# EAGLE design TokTok_WiFi (EAGLE 6.4)
COMPANY: ADAFRUIT INDUSTRIES; DRAWN: KTOWN; REV: C
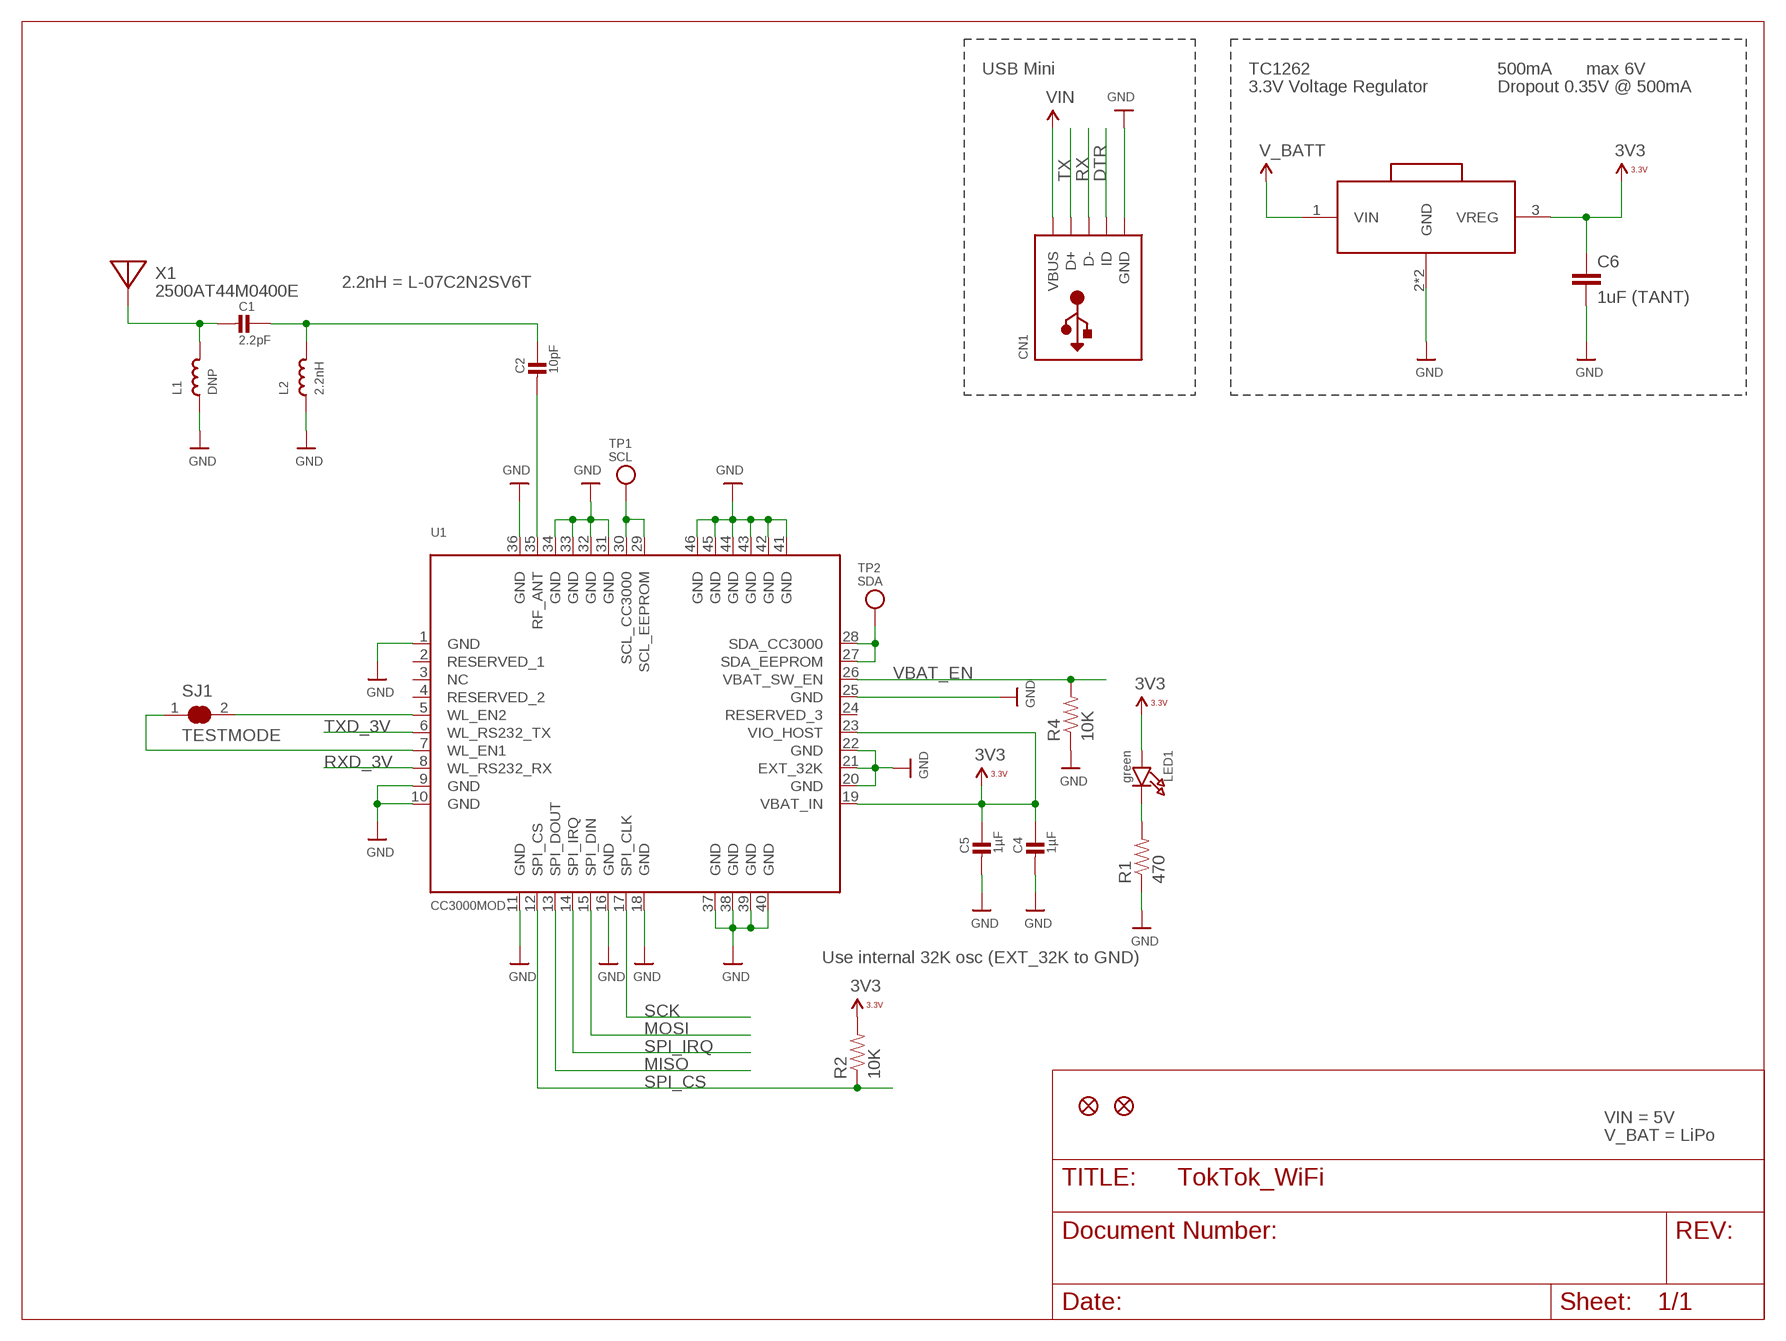
[diagram p0: schematic, sheet 1, part 1 of 2]
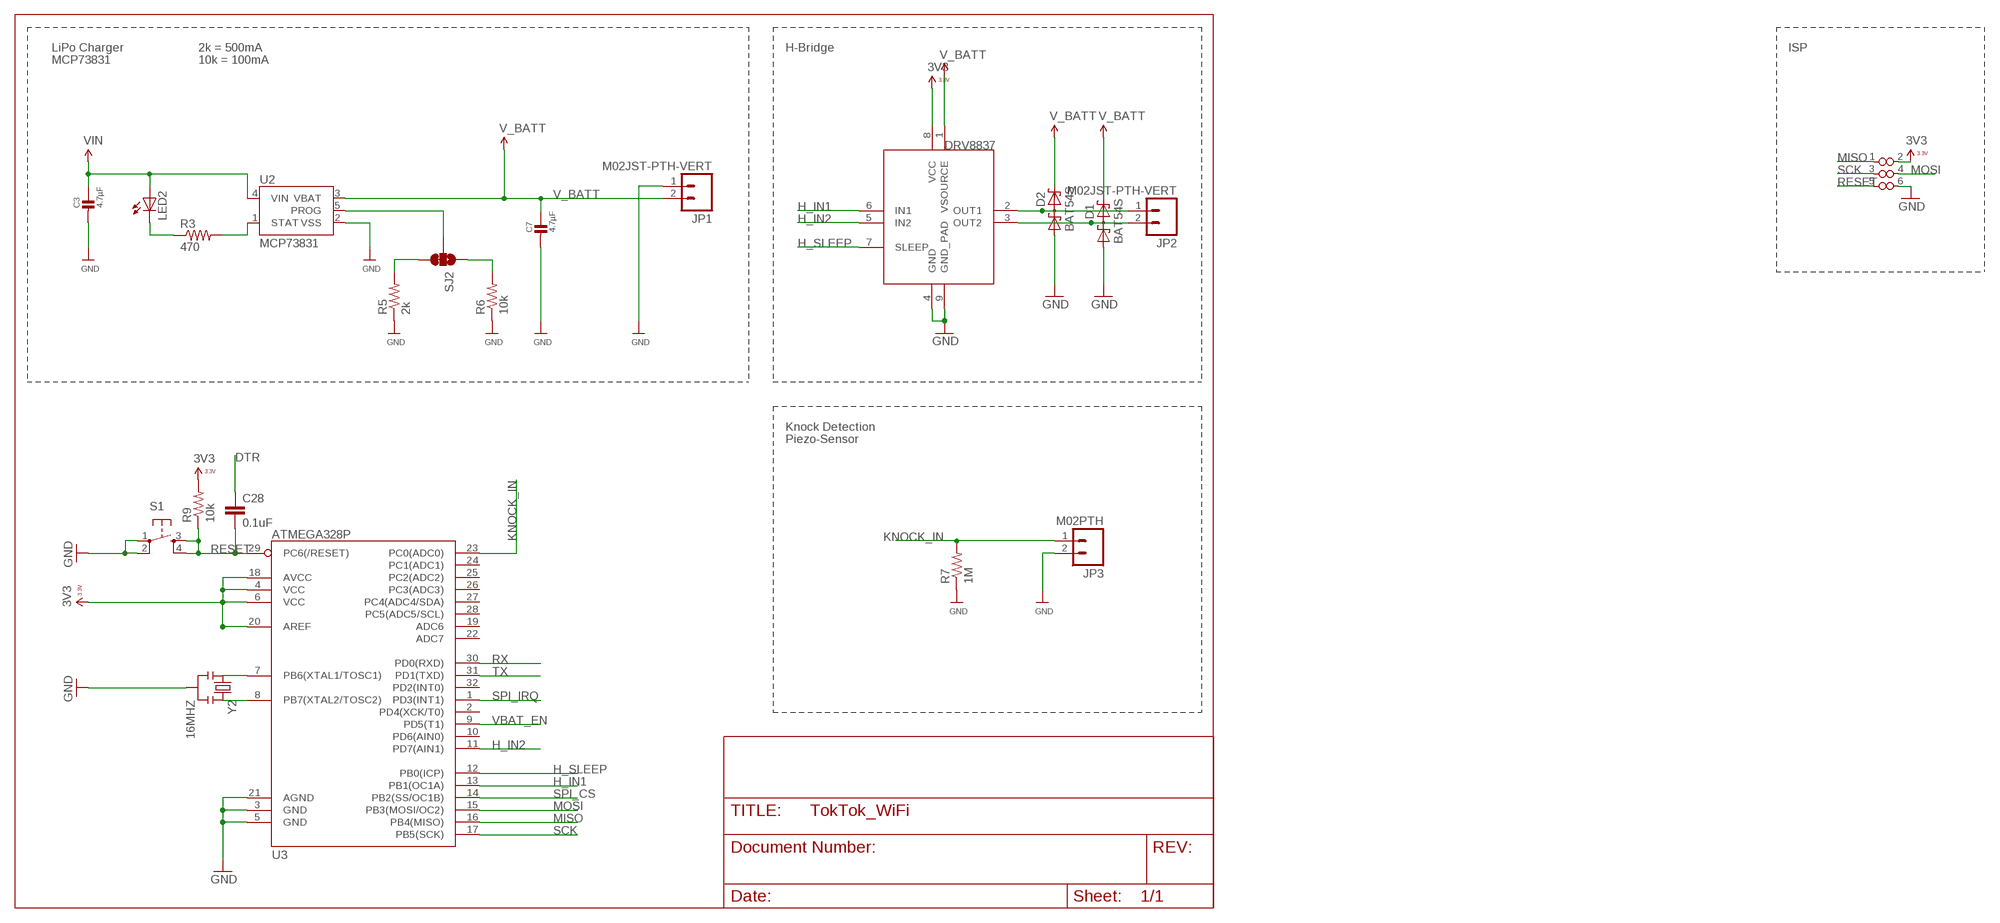
[diagram p1: schematic, sheet 1, part 2 of 2]

## Parts
C1  2.2pF  CAP_CERAMIC_0402  [_0402]
C2  10pF  CAP_CERAMIC_0402  [_0402]
C3  4.7µF  CAP_CERAMIC_0805MP  [_0805MP]
C4  1µF  CAP_CERAMIC_0805MP  [_0805MP]
C5  1µF  CAP_CERAMIC_0805MP  [_0805MP]
C6  1uF (TANT)  CAP1206  [1206]
C7  4.7µF  CAP_CERAMIC_0805MP  [_0805MP]
C28  0.1uF  CAP0805  [0805]
CN1  USBMINIB  [USB-MINIB]
D1  BAT54S  [SOT23]
D2  BAT54S  [SOT23]
FID1  FIDUCIAL""  [FIDUCIAL_1MM]
FID3  FIDUCIAL""  [FIDUCIAL_1MM]
IC2  DRV8837  [WSON-8]
JP1  M02JST-PTH-VERT  [JST-2-PTH-VERT]
JP2  M02JST-PTH-VERT  [JST-2-PTH-VERT]
JP3  M02PTH  [1X02]
L1  DNP  INDUCTOR_0402  [_0402]
L2  2.2nH  INDUCTOR_0402  [_0402]
LED1  green  LED0805_NOOUTLINE  [CHIPLED_0805_NOOUTLINE]
LED2  LEDCHIP-LED0805  [CHIP-LED0805]
R1  470  RESISTOR0805-RES  [0805]
R2  10K  RESISTOR0805-RES  [0805]
R3  470  RESISTOR0805-RES  [0805]
R4  10K  RESISTOR0805-RES  [0805]
R5  2k  RESISTOR0805-RES  [0805]
R6  10k  RESISTOR0805-RES  [0805]
R7  1M  RESISTOR0805-RES  [0805]
R9  10k  R-US_M0805  [M0805]
S1  TAC_SWITCHSMD  [TACTILE-SWITCH-SMD]
SJ1  TESTMODE  SOLDERJUMPER_CLOSED  [SOLDERJUMPER_CLOSEDWIRE]
SJ2  JUMPER-PAD-3-2OF3_NC_BY_TRACE_SMALL  [PAD-JUMPER-3-2OF3_NC_BY_TRACE_YES_SILK_FULL_BOX]
TP1  SCL  TESTPOINTPAD1MM  [TESTPOINT_PAD_1MM]
TP2  SDA  TESTPOINTPAD1MM  [TESTPOINT_PAD_1MM]
U1  CC3000MOD  [CC3000MOD]
U2  MCP73831  [SOT23-5]
U3  ATMEGA328P  ATMEGA328_SMT  [TQFP32-08]
U$3  TC1262  [SOT223]
U$36  ISP_POGO  [POGO_ISP]
X1  2500AT44M0400E  ANTENNA_JOHANSON_2500AT44M0400  [ANT_2500AT44M0400]
Y2  16MHZ  RESONATOR8MHZ  [RESONATOR-SMD]

## Nets
3V3: C4.1 C5.1 C6.1 IC2.8(VCC) LED1.A R2.2 R9.2 U1.19(VBAT_IN) U1.23(VIO_HOST) U3.4(VCC) U3.6(VCC) U3.18(AVCC) U3.20(AREF) U$3.3(VREG) U$36.2(VCC)
DTR: C28.1 CN1.ID
GND: C3.2 C4.2 C5.2 C6.2 C7.2 CN1.GND D1.1(A1) D2.1(A1) IC2.4(GND) IC2.9(GND_PAD) JP1.1 JP3.2 L1.1 L2.1 R1.1 R4.1 R5.1 R6.1 R7.1 S1.1 S1.2 U1.1(GND) U1.9(GND) U1.10(GND) U1.11(GND) U1.16(GND) U1.18(GND) U1.20(GND) U1.21(EXT_32K) U1.22(GND) U1.25(GND) U1.31(GND) U1.32(GND) U1.33(GND) U1.34(GND) U1.36(GND) U1.37(GND) U1.38(GND) U1.39(GND) U1.40(GND) U1.41(GND) U1.42(GND) U1.43(GND) U1.44(GND) U1.45(GND) U1.46(GND) U2.2(VSS) U3.3(GND) U3.5(GND) U3.21(AGND) U$3.2(GND) U$3.4(GND) U$36.6(GND) Y2.2
H_IN1: IC2.6(IN1) U3.13(PB1(OC1A))
H_IN2: IC2.5(IN2) U3.11(PD7(AIN1))
H_SLEEP: IC2.7(SLEEP) U3.12(PB0(ICP))
KNOCK_IN: JP3.1 R7.2 U3.23(PC0(ADC0))
MISO: U1.13(SPI_DOUT) U3.16(PB4(MISO)) U$36.1(MISO)
MOSI: U1.15(SPI_DIN) U3.15(PB3(MOSI/OC2)) U$36.4(MOSI)
N$1: C1.2 L1.2 X1.FEED
N$2: C1.1 C2.1 L2.2
N$3: R3.2 U2.1(STAT)
N$4: C2.2 U1.35(RF_ANT)
N$5: SJ1.2 U1.5(WL_EN2)
N$6: SJ1.1 U1.7(WL_EN1)
N$7: LED1.C R1.2
N$8: LED2.C R3.1
N$9: SJ2.2 U2.5(PROG)
N$10: U3.7(PB6(XTAL1/TOSC1)) Y2.1
N$11: R5.2 SJ2.3
N$12: R6.2 SJ2.1
N$13: U3.8(PB7(XTAL2/TOSC2)) Y2.3
N$21: D2.3(C1A2) IC2.2(OUT1) JP2.1
N$23: D1.3(C1A2) IC2.3(OUT2) JP2.2
RESET: C28.2 R9.1 S1.3 S1.4 U3.29(PC6(/RESET)) U$36.5(RESET)
RX: CN1.D- U3.30(PD0(RXD))
RXD_3V: U1.8(WL_RS232_RX)
SCK: U1.17(SPI_CLK) U3.17(PB5(SCK)) U$36.3(SCK)
SCL_3V: TP1.P$1 U1.29(SCL_EEPROM) U1.30(SCL_CC3000)
SDA_3V: TP2.P$1 U1.27(SDA_EEPROM) U1.28(SDA_CC3000)
SPI_CS: R2.1 U1.12(SPI_CS) U3.14(PB2(SS/OC1B))
SPI_IRQ: U1.14(SPI_IRQ) U3.1(PD3(INT1))
TX: CN1.D+ U3.31(PD1(TXD))
TXD_3V: U1.6(WL_RS232_TX)
V_BATT: C7.1 D1.2(C2) D2.2(C2) IC2.1(VSOURCE) JP1.2 U2.3(VBAT) U$3.1(VIN)
VBAT_EN: R4.2 U1.26(VBAT_SW_EN) U3.9(PD5(T1))
VIN: C3.1 CN1.VBUS LED2.A U2.4(VIN)
Unconnected: U1.2(RESERVED_1) U1.3(NC) U1.4(RESERVED_2) U1.24(RESERVED_3) U3.2(PD4(XCK/T0)) U3.10(PD6(AIN0)) U3.19(ADC6) U3.22(ADC7) U3.24(PC1(ADC1)) U3.25(PC2(ADC2)) U3.26(PC3(ADC3)) U3.27(PC4(ADC4/SDA)) U3.28(PC5(ADC5/SCL)) U3.32(PD2(INT0))

## Notes on the sheet
- USB Mini | TC1262 | 500mA | max 6V | LiPo Charger | 2k = 500mA | H-Bridge | ISP
- 3.3V Voltage Regulator | Dropout 0.35V @ 500mA | MCP73831 | 10k = 100mA
- 2.2nH = L-07C2N2SV6T
- Knock Detection
- Piezo-Sensor
- Use internal 32K osc (EXT_32K to GND)
- VIN = 5V
- V_BAT = LiPo

## Library data of the parts
C1-C5 C7 = microbuilder:CAP_CERAMIC: Ceramic Capacitors For new designs, use the packages preceded by an '_' character since they are more reliable: The following footprints should be used on most boards: _0402 - Standard footprint for regular board layouts _0603 - Standard footprint for regular board layouts _0805 - Standard footprint for regular board layouts For extremely tight-pitch boards where space is at a premium, the following 'micro-pitch' footprints can be used (smaller pads, no silkscreen outline, etc.): _0402MP - Micro-pitch footprint for very dense/compact boards _0603MP - Micro-pitch footprint for very dense/compact boards _0805MP - Micro-pitch footprint for very dense/compact boards Commonly Stocked Parts 0402 - 0402 Surface Mount Capacitors 16pF 50V 5% [Digikey: 445-4899-2-ND] 18pF 50V 5% [Digikey: 490-1281-2-ND] 22pF 50V 5% [Digikey: 490-1283-2-ND] 68pF 50V 5% [Digikey: 490-1289-2-ND] 0.1uF 10V 10% [Digikey: 490-1318-2-ND] 1.0uF 6.3V 10% [Digikey: 490-1320-2-ND] 0603 - 0603 Surface Mount Capacitors 16 pF 50V 5% [Digikey: 445-5051-2-ND] 22 pF 50V [Digikey: PCC220ACVTR-ND] 33 pF 50V 5% [Digikey: 490-1415-1-ND] 56pF 50V 5% [Digikey: 490-1421-1-ND] 220pF 50V 5% [Digikey: 445-1285-1-ND] 680 pF 50V 2200 pF 50V 5% C0G [Digikey: 445-1297-1-ND] 5600 pF 100V 5% X7R [Digikey: 478-3711-1-ND] 0.1 µF 25V 10% [Digikey: PCC2277TR-ND] 0.22 µF 16V 10% X7R [Digikey: 445-1318-1-ND] 1.0 µF 25V 10% [Digikey: 445-5146-2-ND] 0603 - RF Specific 3pF 250V +/-0.1pF RF [Digikey: 712-1347-1-ND] 18 pF 250V 5% [Digikey: 478-3505-1-ND or 712-1322-1-ND] 56 pF 250V 5% C0G RF [Digikey: 490-4867-1-ND] 68 pF 250V RF [Digikey: 490-4868-1-ND] 0805 - 0805 Surface Mount Capacitors 220 pF 250V 2% RF Ceramic Capacitor [Digikey: 712-1398-1-ND] 1000 pF 50V 2% NP0 Ceramic Capacitor [Digikey: 478-3760-1-ND] 0.1 µF 25V 10% Ceramic Capacitor [Digikey: PCC1828TR-ND] 1.0 µF 16V 10% Ceramic Capacitor[Digikey: 490-1691-2-ND] 10.0 µF 10V 10% Ceramic Capacitor[Digikey: 709-1228-1-ND] 10.0 uF 16V 10% Ceramic Capacitor [Digikey: 478-5165-2-ND] 47 uF 6.3V 20% Ceramic Capacitor [Digikey: 587-1779-1-ND or 399-5506-1-ND] 1206 - 1206 Surface Mount Capacitors 47uF 10V 20% Ceramic Capacitor [Digikey: 490-5528-1-ND or 399-5508-1-ND or 445-6010-1-ND] 100uF 6.3V -20%, +80% Y5V Ceramic Capacitor (Digikey: 490-4512-1-ND, Mouser: 81-GRM31CF50J107ZE1L)
C6 C28 = SparkFun-Capacitors:CAP: Capacitor Standard 0603 ceramic capacitor, and 0.1" leaded capacitor.
CN1 = adafruit:USB: USB Connectors USBMINIB - Surface Mount Female Mini-B USB Connector 4UConnector: 06564 By microbuilder.eu Thru-hole RA Female Mini-B USB Connector 4UConnector: 18732 By ladyada.net
D1 D2 = diode:BAT54S: Schottky Diodes Pin connection corrected 2011-05-04 Source: Fairchild .. BAT54.pdf
FID1 FID3 = microbuilder:FIDUCIAL: Fiducial Alignment Points Various fiducial points for machine vision alignment.; BOM: EXCLUDE
IC2 = digikey:DRV8837: DRV8837 DSG - H-Bridge
JP1-JP3 = SparkFun-Connectors:M02: Standard 2-pin 0.1" header. Use with - straight break away headers ( PRT-00116) - right angle break away headers (PRT-00553) - swiss pins (PRT-00743) - machine pins (PRT-00117) - female headers (PRT-00115) Molex polarized connector foot print use with: PRT-08233 with associated crimp pins and housings. 2.54_SCREWTERM for use with PRT-10571. 3.5mm Screw Terminal footprints for PRT-08084 5mm Screw Terminal footprints for use with PRT-08432
L1 L2 = microbuilder:INDUCTOR: Inductors 0603: 10nH Ceramic Inductor - microwire antenna/RF (Digikey: 712-1434-2-ND) 0805: 560nH Ceramic Inductor - RF (Digikey: 553-1047-1-ND) 270nH Ceramic Inductor - Q = 40@250MHz, +-5%, 1 Ohm DC Resistance (Digikey: 535-10506-2-ND) 1007 (2518 Metric) SMT: 10µH 10% 250mOhm 820mA 1007 Inductor (Digikey: 587-2189-1-ND) 22µH 10% 500mOhm 580mA 1007 Inductor (Digikey: 587-2190-1-ND) 47µH 10% 950mOhm 420mA 1007 Inductor (Digikey: 587-2191-1-ND) 47µH 5% 100mOhm 1A 1008 Inductor (Digikey: 732-1816-1-ND) 5.0x5.0mm (Taiyo Yuden NR5040 Series) 6.8µH 20% 2.3A 64mOhm Inductor (Digikey: 587-2374-2-ND) 5.0x5.0mm (TDK VLC5045 Series) 4.7µH 20% 3.3A 34mOhm Inductor (Digikey: 445-6526-1-ND) 6.8µH 20% 2.7A 46mOhm Inductor (Digikey: 445-6527-1-ND) 6.0x6.0mm (TDK VLC6045 Series) 4.7µH 20% 3.8A 27mOhm Inductor (Digikey: 445-6538-2-ND) 6.8µH 20% 3A 41mOhm Inductor (Digikey: 445-6540-1-ND) 6.2µH 30% 2.2A 45mOhm Inductor (Digikey: SRR5028-6R2YCT-ND) - Not TDK VLC6045 but footprint should match 6.0x6.0mm (TDK SLF6045 Series) 6.8uH 30% 2A 33mOhm Inductor (Digikey: 445-4572-1-ND, Mouser: 810-SLF645T6R8N2R0PF) 6.0x6.0mm (Sumida CDRH5D28 Series) 6.2uH 30% 1.8A 45mOhm Inductor (Digikey: 308-1542-1-ND) Taiyo Yuden NR3015T2R2M - 2.2uH 20% 1.5A (Digikey: 587-1648-2-ND, Mouser: 963-NR3015T2R2M) - Used with TI TPS62172 CoilCraft RFID Transponder Coil - MA5532-AE (For use with AS3935 Lightning Sensor)
LED1 = microbuilder:LED: LED
LED2 = adafruit:LED: LED
R1-R7 = SparkFun-Resistors:RESISTOR: Resistor Basic schematic elements and footprints for 0603, 1206, and PTH resistors.
R9 = resistor:R-US_: RESISTOR, American symbol
S1 = SparkFun-Electromechanical:TAC_SWITCH: Momentary Switch Button commonly used for reset or general input. Spark Fun Electronics SKU : COM-00097 SMT- SWCH-08247
SJ1 = microbuilder:SOLDERJUMPER_CLOSED: Solder Jumper - Closed These solder jumpers are closed by default CLOSEDWIRE - 10 mil trace between pads that can be cut and resoldered later CLOSEDPERM - 63 mil trace between pads for a permanent connection (used to 'bridge' two signals, a shameless hack for Eagle). Can double as a test point as well (no cream layer)
SJ2 = SparkFun-Passives:JUMPER-PAD-3-2OF3_NC_BY_TRACE
TP1 TP2 = microbuilder:TESTPOINT: Test Point Various test points for characterisation and PCB testing TESTPOINT_SMT - Compact Surface Mount Test Point [Digikey: 5016KTR-ND]
U1 = microbuilder:CC3000MOD: CC3000MOD Wifi Module
U2 = SparkFun-PowerIC:MCP73831: Miniature single cell, fully integrated Li-Ion, Li-polymer charge management controller http://ww1.microchip.com/downloads/en/DeviceDoc/21984a.pdf IC-09995; PROD_ID: IC-09995
U3 = SparkFun-DigitalIC:ATMEGA328_SMT: 32-Pin Atmega328 part Commonly used on Arduino compatible boards Available in QFP and QFN packages TQFP is IC-09069 QFN is non-stock; PROD_ID: IC-09069
U$3 = digikey:TC1262
U$36 = digikey:ISP_POGO
X1 = microbuilder:ANTENNA_JOHANSON_2500AT44M0400: Johanson 2.3-2.7 GHz Chip Antenna Frequency Range: 2400 - 2500 Mhz Peak Gain 2.5 dBi typ. (XZ-V) Average Gain 0.5 dBi typ. (XZ-V) Input Power 3W max. Operating Temperature -40 to +85°C Digikey: 712-1403-1-ND Mouser: 609-2500AT44M0400E
Y2 = SparkFun-FreqCtrl:RESONATOR: Resonator Small SMD resonator. Used, eg, on the Arduino Pro/ Pro Mini boards. 8MHz- XTAL-08895 16MHz- XTAL-08900; PROD_ID: XTAL-08895; VALUE: 8MHZ

## Board
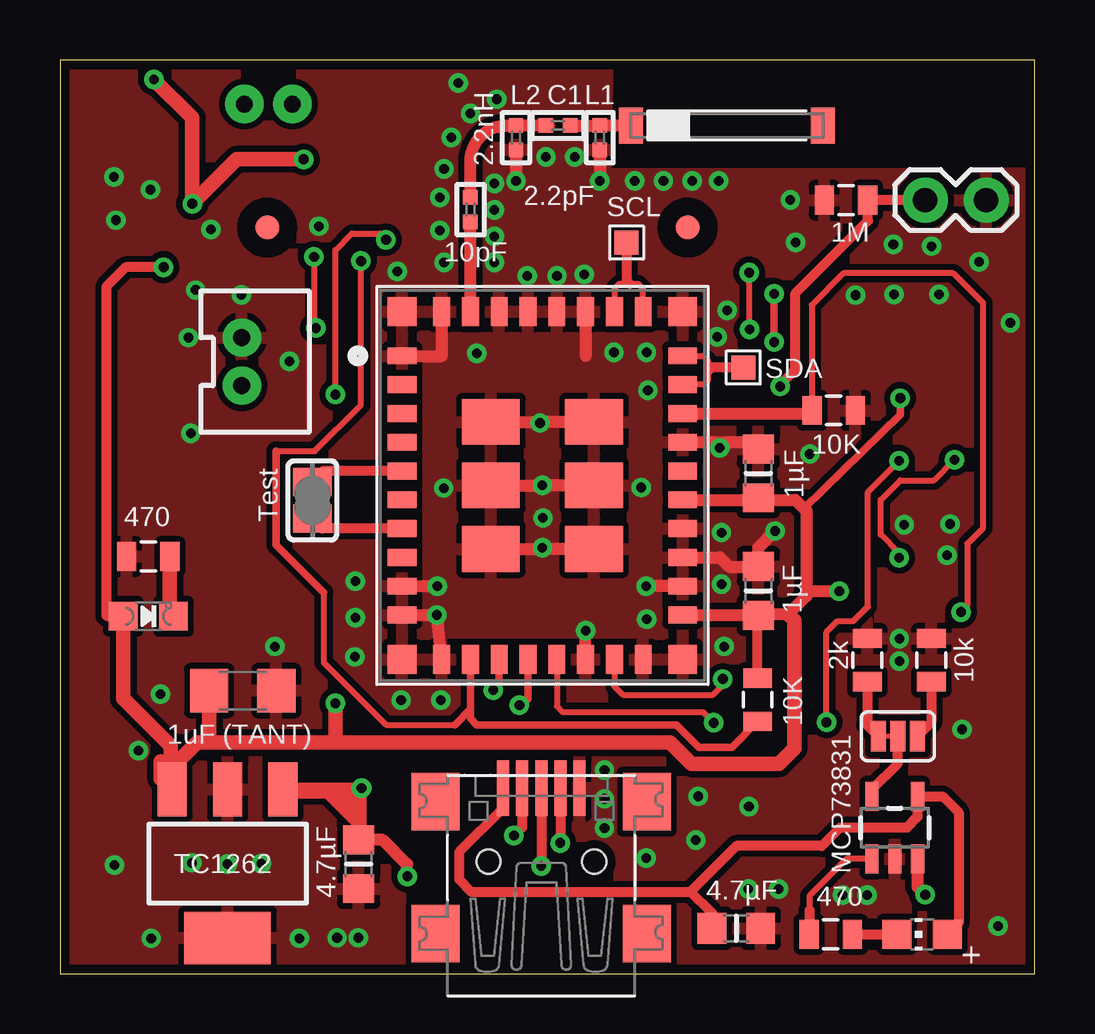
[diagram p2: board, top side]
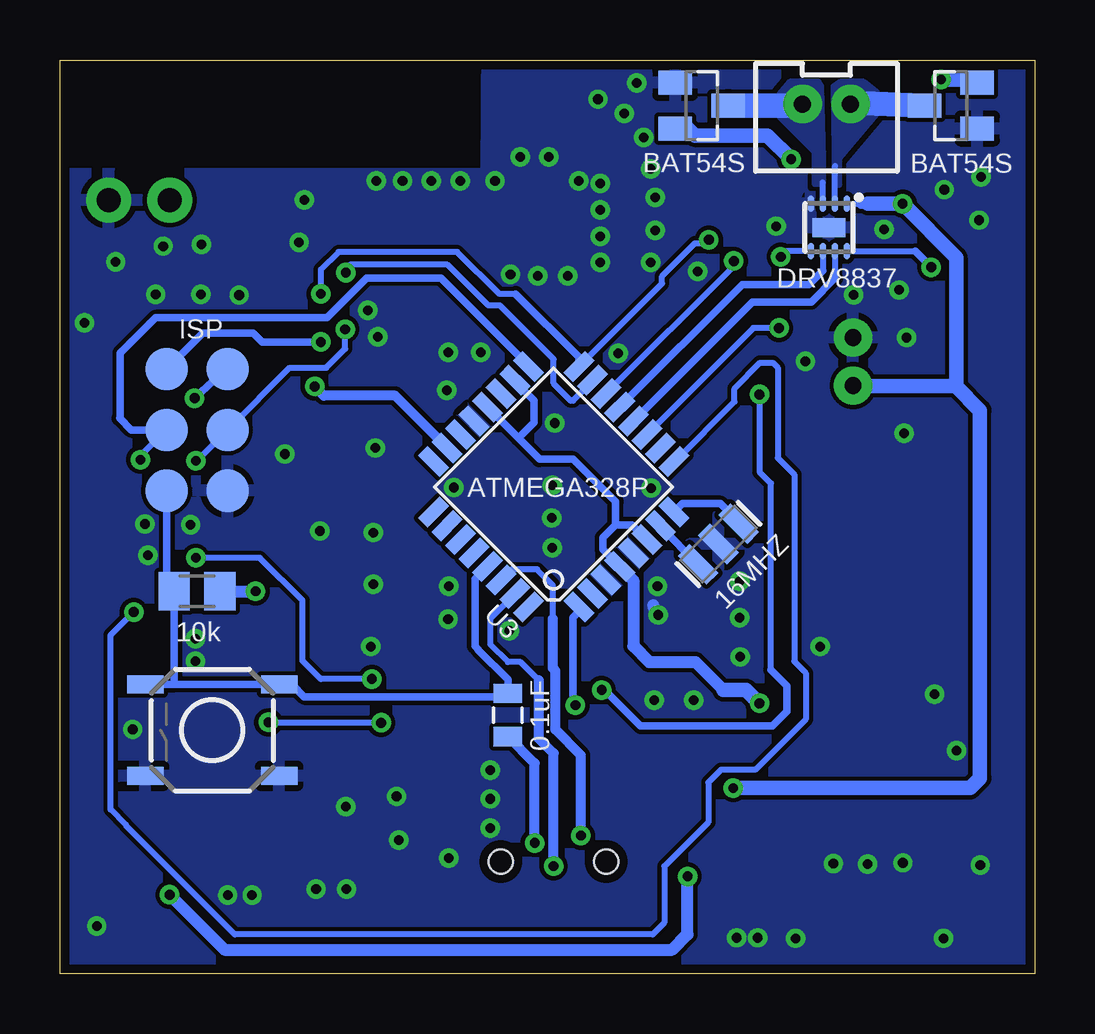
[diagram p3: board, bottom side, seen from below]

Size 40.64 x 38.1 mm. Coordinates in mm from the lower left corner, seen from the top.
Outline: 0,0 40.64,0 40.64,38.1 0,38.1 0,0
Copper layers (1*16): Top 0.035mm / dielectric 1.5mm / Bottom 0.035mm
Design rules "adafruit *": minimum track width 7mil, minimum drill 13mil, track to track 7mil, track to pad 7mil, pad to pad 7mil, via to via 7mil, smd to smd 7mil, copper to edge 15mil, drill to drill 8mil, minimum pad ring 10mil, minimum via ring 8mil, stop-mask expansion 4mil, vias tented up to drill 20mil, thermal gap 10mil

### Footprints (pad centres in the part's own frame; a part is rotated, then mirrored left to right if it is on the bottom)
_0402 = smd 0.6 x 0.6: 1 -0.508,0; 2 0.508,0
_0805MP = smd 1.2 x 1.3: 1 -1.016,0; 2 1.016,0
1206 = smd 1.6 x 1.8: 1 -1.4,0; 2 1.4,0
0805 = smd 0.8 x 1.2: 1 -0.9,0; 2 0.9,0
USB-MINIB = smd 0.5 x 2.308: D+ 0,4.064; D- -0.8,4.064; GND 1.6,4.064; ID 0.8,4.064; VBUS -1.6,4.064 | smd 2 x 2.4: GND1 -4.4,-2; GND2 -4.4,3.5; GND3 4.4,3.5; GND4 4.4,-2 | hole 1: -2.2,1; 2.2,1
SOT23 = smd 1 x 1.4: 1 -0.95,-1.1; 2 0.95,-1.1; 3 0,1.1
FIDUCIAL_1MM = smd 1 x 1: 1 0,0
WSON-8 = smd 0.7 x 0.279: 1 -0.99,0.75; 2 -0.99,0.25; 3 -0.99,-0.25; 4 -0.99,-0.75; 5 0.99,-0.75; 6 0.99,-0.25; 7 0.99,0.25; 8 0.99,0.75 | smd 0.8 x 1.38: 9 0,0
JST-2-PTH-VERT = drill 0.7 pad 1.6: 1 -1,-0.55; 2 1,-0.55
1X02 = drill 1.016 pad 1.88: 1 0,0; 2 2.54,0
CHIPLED_0805_NOOUTLINE = smd 1.2 x 1.2: A 0,-1.05; C 0,1.05
CHIP-LED0805 = smd 1.2 x 1.2: A 0,-1.05; C 0,1.05
M0805 = smd 1.3 x 1.6: 1 -0.95,0; 2 0.95,0
TACTILE-SWITCH-SMD = smd 1.524 x 0.762: 1 -2.794,1.905; 2 2.794,1.905; 3 -2.794,-1.905; 4 2.794,-1.905
SOLDERJUMPER_CLOSEDWIRE = smd 1.168 x 1.6: 1 -0.762,0; 2 0.762,0 | smd 0.635 x 0.203: WIRE 0,0
PAD-JUMPER-3-2OF3_NC_BY_TRACE_YES_SILK_FULL_BOX = smd 0.635 x 1.27: 1 -0.813,0; 2 0,0; 3 0.813,0
TESTPOINT_PAD_1MM = smd 1 x 1: P$1 0,0
CC3000MOD = smd 1.2 x 0.7: 1 -5.85,5.4; 2 -5.85,4.2; 3 -5.85,3; 4 -5.85,1.8; 5 -5.85,0.6; 6 -5.85,-0.6; 7 -5.85,-1.8; 8 -5.85,-3; 9 -5.85,-4.2; 10 -5.85,-5.4; 19 5.85,-5.4; 20 5.85,-4.2; 21 5.85,-3; 22 5.85,-1.8; 23 5.85,-0.6; 24 5.85,0.6; 25 5.85,1.8; 26 5.85,3; 27 5.85,4.2; 28 5.85,5.4 | smd 0.7 x 1.2: 11 -4.2,-7.25; 12 -3,-7.25; 13 -1.8,-7.25; 14 -0.6,-7.25; 15 0.6,-7.25; 16 1.8,-7.25; 17 3,-7.25; 18 4.2,-7.25; 29 4.2,7.25; 30 3,7.25; 31 1.8,7.25; 32 0.6,7.25; 33 -0.6,7.25; 34 -1.8,7.25; 35 -3,7.25; 36 -4.2,7.25 | smd 2.4 x 1.9: 37 -2.15,2.65; 38 -2.15,0; 39 -2.15,-2.65; 40 2.15,2.65; 41 2.15,0; 42 2.15,-2.65 | smd 1.2 x 1.2: 43 -5.85,7.25; 44 -5.85,-7.25; 45 5.85,-7.25; 46 5.85,7.25
SOT23-5 = smd 0.55 x 1.2: 1 -0.95,-1.3; 2 0,-1.3; 3 0.95,-1.3; 4 0.95,1.3; 5 -0.95,1.3
TQFP32-08 = smd 1.27 x 0.559: 1 -4.293,2.8; 2 -4.293,2; 3 -4.293,1.2; 4 -4.293,0.4; 5 -4.293,-0.4; 6 -4.293,-1.2; 7 -4.293,-2; 8 -4.293,-2.8; 17 4.293,-2.8; 18 4.293,-2; 19 4.293,-1.2; 20 4.293,-0.4; 21 4.293,0.4; 22 4.293,1.2; 23 4.293,2; 24 4.293,2.8 | smd 0.559 x 1.27: 9 -2.8,-4.293; 10 -2,-4.293; 11 -1.2,-4.293; 12 -0.4,-4.293; 13 0.4,-4.293; 14 1.2,-4.293; 15 2,-4.293; 16 2.8,-4.293; 25 2.8,4.293; 26 2,4.293; 27 1.2,4.293; 28 0.4,4.293; 29 -0.4,4.293; 30 -1.2,4.293; 31 -2,4.293; 32 -2.8,4.293
SOT223 = smd 1.219 x 2.235: 1 -2.311,-3.099; 2 0,-3.099; 3 2.311,-3.099 | smd 3.6 x 2.2: 4 0,3.099
POGO_ISP = smd 1.778 x 1.778: 1 -1.27,2.54; 2 1.27,2.54; 3 -1.27,0; 4 1.27,0; 5 -1.27,-2.54; 6 1.27,-2.54
ANT_2500AT44M0400 = smd 1 x 1.5: FEED 4,0; NC -4,0
RESONATOR-SMD = smd 0.7 x 1.7: 1 -1.2,0; 2 0,0; 3 1.2,0

### Placement (x,y rotation side)
C1  20.76,35.37 0 top
C2  17.11,31.86 270 top
C3  28.19,1.91 0 top
C4  29.11,20.86 90 top
C5  29.11,15.96 90 top
C6  7.62,11.81 0 top
C7  12.45,4.57 270 top
C28  21.97,10.79 90 bottom
CN1  20.07,3.68 0 top
D1  13.89,36.2 270 bottom
D2  3.51,36.2 90 bottom
FID1  26.16,31.11 0 top
FID3  8.64,31.11 0 top
IC2  8.59,31.11 270 bottom
JP1  8.13,25.53 270 top
JP2  8.69,35.71 180 bottom
JP3  36.07,32.26 0 top
L1  22.5,34.87 90 top
L2  19.01,34.87 90 top
LED1  3.68,14.91 270 top
LED2  35.94,1.65 90 top
R1  3.68,17.4 0 top
R2  29.08,11.43 90 top
R3  32.13,1.65 180 top
R4  32.26,23.5 180 top
R5  33.66,13.08 270 top
R6  36.32,13.08 270 top
R7  32.77,32.26 0 top
R9  34.92,15.95 0 bottom
S1  34.29,10.16 180 bottom
SJ1  10.52,19.74 90 top
SJ2  34.92,9.91 180 top
TP1  23.62,30.49 270 top
TP2  28.48,25.28 270 top
U1  20.11,20.36 0 top
U2  34.8,6.1 0 top
U3  20.06,20.3 135 bottom
U$3  6.99,4.6 180 top
U$36  34.92,22.68 0 bottom
X1  27.8,35.37 180 top
Y2  13.19,17.92 45 bottom

### Tracks (layer width: path | path; a pad name or v marks a point on that pad's centre or on a via)
3V3  (via drill 0.41)
  Top 0.305: v35.03,24 35.03,23.32 31.01,19.41
  Top 0.406: R2.2 29.08,14.92 C5.1 | v4.32,29.46 2.74,29.46 1.93,28.65 1.93,14.93 LED1.A
  Top 0.508: U1.23 29.03,19.77 | 29.03,19.77 C4.1 | U1.19 29.1,14.96 C5.1 29.15,14.99 30.35,14.99 31.11,15.75 31.11,16.03 | 29.03,19.77 30.65,19.77 31.01,19.41 31.11,19.3 31.11,16.03 | v32.49,15.95 31.19,15.95 31.11,16.03
  Top 0.61: 4.2,8.14 U$3.3 | 4.57,7.77 U$3.3 | C6.1 6.22,9.78 6.1,9.65 | 6.1,9.65 5.71,9.65 4.2,8.14 | 30.35,14.99 30.61,14.73 30.61,9.4 29.97,8.76 26.31,8.76 25.43,9.65 11.63,9.65 | 6.1,9.65 11.63,9.65 | v11.48,11.28 11.48,9.8 11.63,9.65 | 4.2,8.14 4.2,8.85 | LED1.A 2.64,14.9 2.64,11.48 4.62,9.5 4.62,7.72 U$3.3
  Bottom 0.254: IC2.8 4.98,30.12
  Bottom 0.305: U3.6 16.79,18.72 17.48,18.72 | 17.48,18.72 18.01,18.19 18.01,17.69 U3.4 | 17.48,18.72 17.48,19.68 19.25,21.46 20.65,21.46 21.53,22.34 | 21.53,22.34 U3.20 | U3.18 21.68,24.7 20.88,23.9 20.88,22.99 21.53,22.34 | U$36.2 33.71,25.22 v35.03,24 | 4.98,30.12 v4.32,29.46
  Bottom 0.508: R9.2 v32.49,15.95 | U3.4 17.31,16.98 16.74,16.41 16.74,13.66 16.08,13.01 14.15,13.01 12.98,11.84
  Bottom 0.61: 12.98,11.84 12.04,11.84 v11.48,11.28
DTR  (via drill 0.41)
  Top 0.406: CN1.ID 20.87,5.47 v20.85,5.46
  Bottom 0.406: v20.85,5.46 20.85,8.78 C28.1
GND  (via drill 0.4)
  Top 0.5: U1.10 v15.71,14.96 U1.11 | U1.9 v15.73,16.16 | U1.37 20.06,23.02 v20.01,22.96 20.16,23.02 U1.40 | U1.38 v20.11,20.36 U1.41 | U1.39 20.06,17.71 v20.11,17.77 20.16,17.71 U1.42 | v29.81,18.46 29.11,17.77 C5.2 29.1,16.96 27.91,16.96 27.51,17.36 U1.21 | U1.25 28.83,22.16 C4.2 | U1.20 v24.44,16.16 | U1.16 v21.91,14.31 | U1.1 15.91,25.77 U1.36 | U1.31 21.91,25.77 | L2.1 v19.01,33.06 | L1.1 v22.5,33.06
  Bottom 0.5: v15.71,14.96 15.91,15.37
  other vias: 24.51,24.33 24.46,14.79 27.69,13.65 17.37,25.87 23.09,25.92 14.06,29.29 12.29,13.22 18.11,29.66 16.01,29.66 15.83,32.37 15.83,31 16.01,33.56 16.31,34.87 17.11,35.87 18.21,36.47 20.26,34.06 21.46,34.06 27.81,27.66 35.2,18.73 31.26,21.67 23.96,33.06 25.16,33.06 26.36,33.06 27.46,33.06 18.11,32.95 18.11,31.85 18.11,30.75 12.31,14.84 12.31,16.37 14.22,11.41 15.87,11.41 33.65,3.29 32.63,3.29 28.7,3.54 29.96,3.54 12.44,1.51 11.55,1.51 4.18,11.67 27.5,21.93 24.44,4.84 6.29,31.04 10.78,31.17 8.96,13.65 6.98,4.58 8.4,4.61 5.5,4.63 3.27,9.31 36.65,28.33 33.17,28.3 34.77,28.33 34.99,13.98 34.99,13.04 36.97,17.46 37.1,18.75 27.57,18.4 27.57,16.24 24.45,25.92 27.4,26.55 19.47,29.09 20.72,29.09 30.67,30.49 30.45,32.27 34.74,30.41 36.34,30.34 38.32,29.68 5.35,26.53 7.56,28.31 9.57,25.54 5.65,28.51 3.8,1.48 9.97,1.48 22.7,8.49 22.7,7.3 22.7,6.08 26.61,7.4 26.51,5.57 28.72,6.97 37.61,10.2 2.25,33.23 2.33,31.42 3.77,32.69 16.6,37.14 5.45,22.53 24.22,20.28 15.99,20.25 21.86,29.17 20.13,19.01 2.28,4.53 39.11,1.99 39.61,27.14
  pour Bottom (rank 2): 42.76,-0.3 42.76,33.37 22.86,33.37 22.81,38.91 -1.68,39.06 -1.27,-0.25 0.13,-0.3
  pour Top (isolate 0.254): 22.83,38.65 22.73,33.37 33.49,33.37 41.91,33.4 41.66,-0.81 -1.78,-0.68 -1.78,38.98
H_IN1
  Bottom 0.254: IC2.6 8.84,29.32
  Bottom 0.305: 8.84,29.32 9.42,28.73 12.2,28.73 U3.13
H_IN2  (via drill 0.41)
  Top 0.254: v10.59,29.9 10.59,27 v10.67,26.92
  Bottom 0.254: IC2.5 10.36,30.12 v10.59,29.9 | v10.67,26.92 11.74,26.92 U3.11
H_SLEEP
  Bottom 0.254: IC2.7 8.34,29
  Bottom 0.305: 8.34,29 9.32,28.02 11.78,28.02 U3.12
KNOCK_IN  (via drill 0.41)
  Top 0.406: JP3.1 R7.2 33.68,32.24 33.68,31.39 30.66,28.37 30.66,25.2 30.02,24.56 v30.02,24.49
  Bottom 0.406: U3.23 24.51,21.94 26.67,24.11 29.64,24.11 v30.02,24.49
MISO  (via drill 0.41)
  Top 0.254: v11.48,24.16 11.48,30.18 12.17,30.86 13.34,30.86 v13.59,30.61
  Top 0.305: v29.77,28.35 v29.77,26.34 | U1.13 18.31,12.09 v18.06,11.84
  Bottom 0.254: 11,12.68 11,20.45 11.48,20.93 v11.48,24.16 | 19,25.71 18.61,25.71 15.54,28.78 15.54,29.08 14.17,30.45 13.74,30.45 v13.59,30.61 | 21.64,28.35 22.33,28.35 24.08,30.1 29.03,30.1 29.77,29.36 v29.77,28.35
  Bottom 0.305: U3.16 19,25.71 21.64,28.35 | v29.77,26.34 32.21,26.34 32.59,26.72 34.7,26.72 U$36.1 | v18.06,11.84 17.93,11.84 16.43,10.34 10.95,10.34 10.34,10.95 10.34,12.01 11,12.68
MOSI  (via drill 0.41)
  Top 0.254: U1.15 20.71,11.16 20.95,10.92 26.8,10.92 v27.25,10.46 | v31.95,10.49 31.95,14.25 32.41,14.71 33.07,14.71 33.68,15.32 33.68,20.09 v34.98,21.39 | v28.73,29.23 28.73,27.13 v28.75,26.87
  Bottom 0.254: v27.25,10.46 31.93,10.46 v31.95,10.49 | v34.98,21.39 34.95,21.39 U$36.4 31.06,25.27 29.54,25.27 28.75,26.06 v28.75,26.87 | U3.15 18.44,24.72 19.25,23.9 19.36,23.9 20.07,24.61 20.07,25.63 22.3,27.86 22.78,27.86 24.49,29.57 28.55,29.57 v28.73,29.23
  Bottom 0.305: U$36.4 33.22,22.68
N$1
  Top 0.508: C1.2 22.6,35.37 | L1.2 X1.FEED
  Top 0.584: 22.6,35.37 arc90 L1.2
N$2
  Top 0.508: C2.1 17.11,33.87 arc-90 18.61,35.37 19.1,35.37 | L2.2 20.34,35.37
  Top 0.584: 19.1,35.37 arc90 L2.2 | 20.34,35.37 arc-90 C1.1
N$3
  Top 0.254: U2.1 32.79,4.8 31.24,3.25 31.24,2.67
  Top 0.406: 31.24,2.67 31.24,1.66 R3.2
N$4
  Top 0.508: U1.35 C2.2
N$5
  Top 0.406: U1.5 10.99,20.96 SJ1.2
N$6
  Top 0.406: U1.7 10.94,18.57 SJ1.1
N$7
  Top 0.61: R1.2 4.58,15.06 LED1.C
N$8
  Top 0.406: R3.1 LED2.C
N$9
  Top 0.406: U2.5 33.85,7.69 34.92,8.76 SJ2.2
N$10
  Bottom 0.305: U3.7 15.61,18.64 Y2.1
N$11
  Top 0.406: R5.2 33.66,10.36 SJ2.3
N$12
  Top 0.406: R6.2 36.32,10.49 SJ2.1
N$13
  Bottom 0.305: Y2.3 12.34,18.85 13.11,19.61 14.69,19.61 U3.8
N$21
  Bottom 0.254: IC2.2 8.33,33.68
  Bottom 1.016: D2.3 7.69,36.32 JP2.1
  pour Bottom (no thermals): 8.33,32.89 8.15,32.89 8.15,34.01 6.58,35.86 6.58,36.75 7.14,37.19 8.1,37.19 8.41,36.98
N$23
  Bottom 0.254: IC2.3 8.84,32.99
  Bottom 1.016: D1.3 9.69,36.2 JP2.2
  pour Bottom (no thermals): 8.92,37.01 8.84,33.93 8.84,32.92 9.17,32.92 9.17,34.26 10.64,35.74 10.64,36.68 10.19,37.21 9.04,37.21
RESET
  Bottom 0.305: U3.29 23.34,16.46 23.34,13.66 23.19,13.51 23.19,13.49 21.97,12.27 C28.2 22.11,11.56 30.45,11.56 30.96,12.06 S1.3 35.94,12.06 | 35.94,12.06 S1.4 | 35.94,12.06 35.88,12.13 R9.1 36.2,16.27 U$36.5
RX  (via drill 0.41)
  Top 0.406: CN1.D- 19.27,6.11 v18.92,5.77
  Bottom 0.254: 20.09,14.81 20.09,16.2 20.75,16.87 21.8,16.87 U3.30
  Bottom 0.406: v18.92,5.77 18.92,9.12 19.99,10.19 19.99,12.65 20.09,12.75 20.09,14.81
SCK  (via drill 0.41)
  Top 0.254: U1.17 23.11,11.99 23.47,11.63 27.23,11.63 27.69,12.09 27.69,12.24 v27.64,12.29 | 37.26,21.41 v37.29,21.44 36.42,20.57 35.03,20.57 34.21,19.76 34.21,18.31 34.98,17.55 v34.98,17.35
  Bottom 0.254: v27.64,12.29 29.77,12.29 30.53,13.06 30.53,15.57 32.31,17.35 v34.98,17.35 | v37.29,21.44 37.29,21.59 U$36.3
  Bottom 0.305: U3.17 21.11,25.36 24.77,29.01 27.86,29.01 29.52,27.36 36.65,27.36 38.12,25.88 38.12,23.19 38.15,23.16 37.67,22.68 U$36.3
SCL_3V
  Top 0.25: U1.29 24.31,28.57 24.11,28.77 23.75,28.77 23.31,28.77 23.11,28.57 U1.30
  Top 0.406: TP1.P$1 23.62,28.89 23.75,28.77
SDA_3V
  Top 0.25: U1.28 26.81,25.77 27.01,25.57 27.01,25.15 27.01,24.77 26.81,24.57 U1.27
  Top 0.406: TP2.P$1 27.15,25.28 27.01,25.15
SPI_CS  (via drill 0.41)
  Top 0.254: 9.02,21.79 10.62,21.79 12.55,23.72 v12.55,29.72 | 11,15.9 11,12.98 13.59,10.39 16.46,10.39
  Top 0.305: R2.1 28,9.45 26.64,9.45 25.7,10.39 17.37,10.39 17.11,10.65 U1.12 17.11,11.04 16.46,10.39 | 11,15.9 9.02,17.88 9.02,21.79
  Top 0.406: 28.83,10.67 R2.1
  Bottom 0.254: v12.55,29.72 12.55,29.51 U3.14
SPI_IRQ  (via drill 0.41)
  Top 0.305: U1.14 19.51,11.46 v19.15,11.2
  Bottom 0.305: U3.1 19,15.11 19.25,14.86 19.25,11.2 v19.15,11.2
TX  (via drill 0.41)
  Top 0.406: CN1.D+ v20.07,4.5
  Bottom 0.254: 20.68,12.24 21.44,13.01 21.97,13.01 22.71,13.74 22.71,14.81 21.68,15.84 U3.31
  Bottom 0.406: v20.07,4.5 20.07,9.2 20.68,9.8 20.68,12.24
V_BATT  (via drill 0.41)
  Top 0.508: U2.3 35.75,3.62 v36.07,3.3 | v14.48,4.06 14.48,4.57 13.46,5.59 C7.1
  Top 0.61: C7.1 12.45,6.35 11.18,7.62 9.35,7.62 U$3.1 12.37,7.67 | 12.5,7.67 v12.57,7.75 | 12.5,7.67 12.5,5.51 12.45,5.46 | 12.5,7.67 12.37,7.67 | 12.37,7.67 11.94,7.24 | v10.16,33.96 7.37,33.96 v5.51,32.11 5.51,35.69 v3.91,37.29
  Bottom 0.254: IC2.1 7.24,32.1 7.24,32.11
  Bottom 0.406: 7.24,32.11 6.96,32.11
  Bottom 0.508: v36.07,3.3 33.78,1.02 15.11,1.02 14.48,1.65 v14.48,4.06
  Bottom 0.61: v12.57,7.75 2.69,7.75 2.29,8.15 2.29,23.5 3.3,24.51 | 3.3,24.51 7.56,24.51 JP1.2 | 6.96,32.11 v5.51,32.11 3.28,29.87 3.28,24.54 3.3,24.51 | D1.2 14.47,35.24 14.17,34.95 11.15,34.95 v10.16,33.96 | v3.91,37.29 2.52,37.29 D2.2
VBAT_EN  (via drill 0.41)
  Top 0.254: R4.2 31.34,23.51 31.34,27.89 32.66,29.21 37.24,29.21 38.48,27.96 38.48,18.59 37.82,17.93 37.82,15.34 v37.57,15.09
  Top 0.508: U1.26 31.11,23.36 R4.2
  Bottom 0.254: U3.9 15.01,21.36 12.52,23.85 12.52,24.41 11.46,25.48 10.92,25.48 10.72,25.27 10.72,21.51 10.03,20.83 10.03,13.03 9.55,12.55 9.55,10.62 11.66,8.51 13.08,8.51 13.61,7.98 13.61,6.33 15.44,4.5 15.44,2.13 15.93,1.65 33.35,1.65 37.9,6.2 37.9,6.22 38.53,6.86 38.53,14.12 v37.57,15.09
VIN
  Top 0.406: U2.4 35.78,7.4 | U2.4 36.8,7.4 37.47,6.73 37.47,2.12 LED2.A | 26.29,3.43 17.14,3.43 16.64,3.94 16.64,5.08 18.47,6.91 CN1.VBUS | 26.29,3.43 28.19,5.33 31.75,5.33 32.51,6.1 35.31,6.1 35.75,6.54 U2.4 | C3.1 27.18,2.54 26.29,3.43

### Text on the board
tPlace: Test